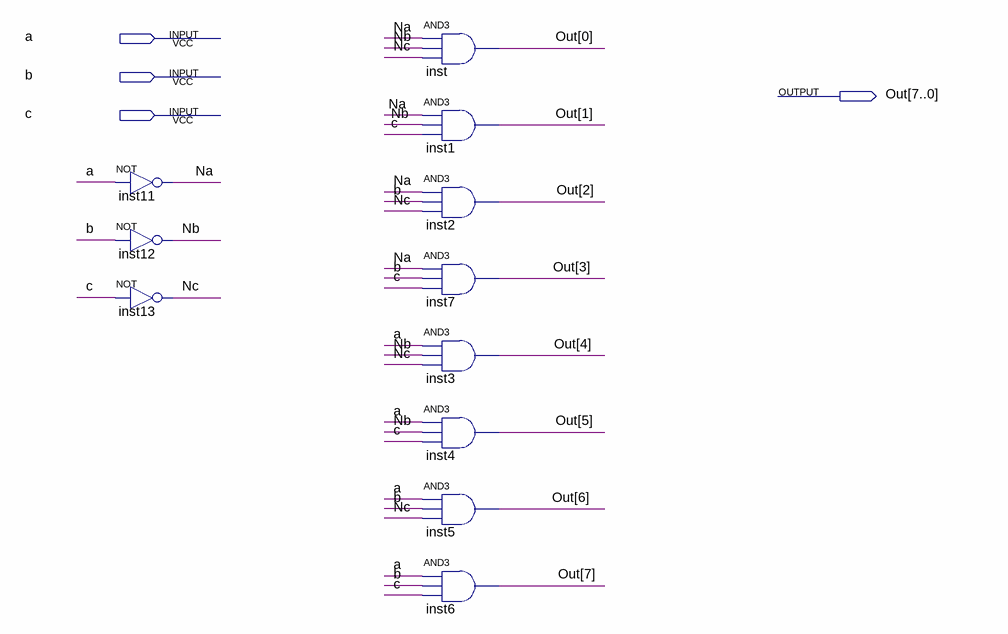
[diagram p0: schematic sheet]
// Quartus schematic DECOD_3x8.bdf as structural Verilog: 11 symbols, 4 pins
module DECOD_3x8 (
  input  a,
  input  b,
  input  c,
  output [7:0] Out
);

  wire Na, Nb, Nc;

  not inst11 (Na, a);
  not inst12 (Nb, b);
  not inst13 (Nc, c);
  and inst (Out[0], Na, Nb, Nc);
  and inst1 (Out[1], Na, Nb, c);
  and inst2 (Out[2], Na, b, Nc);
  and inst7 (Out[3], Na, b, c);
  and inst3 (Out[4], a, Nb, Nc);
  and inst4 (Out[5], a, Nb, c);
  and inst5 (Out[6], a, b, Nc);
  and inst6 (Out[7], a, b, c);
endmodule
